# Altium schematic sheet MT3608.SchDoc
size A4; SheetNumber: 7; SheetTotal: 7
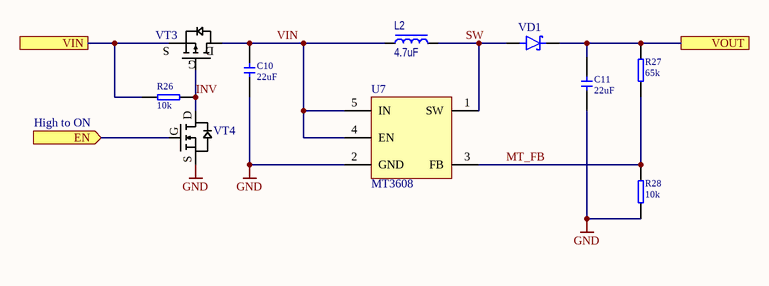
[diagram p0: MT3608.SchDoc]

## Parts
C10  value 22uF  [CERCAP 0805]
C11  value 22uF  [CERCAP 0805]
L2  value 4.7uF  [FXL0420]
R26  value 10k  [RES 0402]
R27  value 65k  [RES 0402]
R28  value 10k  [RES 0402]
U7  MT3608  [SOT23-6]
VD1  (no value)  [SOD-123]
VT3  BSS84  [SOT23-3]  (value not drawn)
VT4  2N7002  [SOT23-3]  (value not drawn)

## Ports
EN (in), VIN, VOUT

## Nets
GND: C10.1 C11.1 R28.1 U7.2(GND) VT4.S1
EN: VT4.G2 ; port EN
INV: R26.2 VT3.G2 VT4.D6
MT_FB: R27.1 R28.2 U7.3(FB)
SW: L2.2 U7.1(SW) VD1.A(Anode)
VIN: C10.2 L2.1 U7.4(EN) U7.5(IN) VT3.D1
VIN: R26.1 VT3.S1 ; port VIN  [a separate net that carries the same name]
VOUT: C11.2 R27.2 VD1.C(Cathode) ; port VOUT

## Notes on the sheet
- High to ON
- (in symbol !Generic N MOSFET) D; G; S
- (in symbol !Generic P MOSFET) S; D; G

## Library data of the parts
C10 C11 = !Capacitor: Capacitor; IsSMT: NoSMT; Diel: X7R; Voltage: *
L2 = Inductor: IsSMT: NoSMT
R26-R28 = !Resistor: Resistor; IsSMT: NoSMT
U7 = MT3608: Integrated Circuit; Manufacturer_Name: Aerosemi; Datasheet Link: https://www.olimex.com/Products/Breadboarding/BB-PWR-3608/resources/MT3608.pdf; Height: 1.45mm; Manufacturer_Part_Number: MT3608
VD1 = DiodeS: Diode Shottky; IsSMT: NoSMT
VT3 = !Generic P MOSFET: generic P mosfet; pin to pad: D1>3 G2>1 S1>2; IsSMT: NoSMT
VT4 = !Generic N MOSFET: generic N mosfet; pin to pad: D6>3 G2>1 S1>2; IsSMT: NoSMT